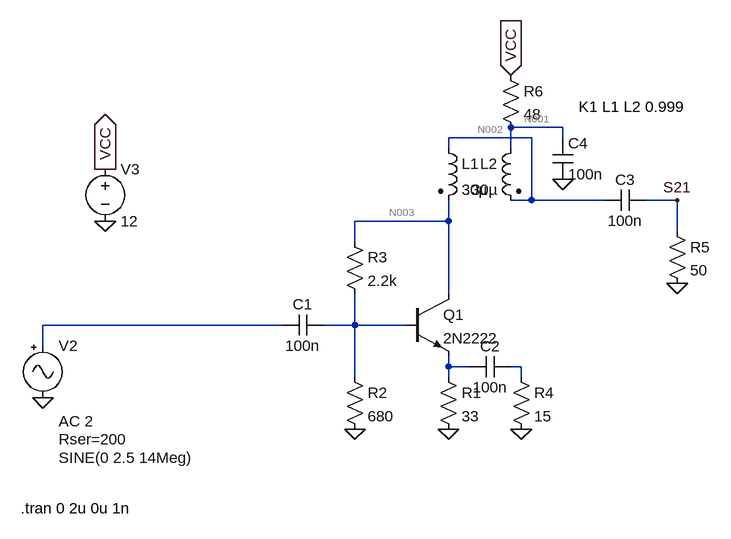
[diagram p0: schematic RF Driver.asc]
RF Driver.asc, the LTspice schematic file:
Version 4
SHEET 1 880 680
WIRE 352 -80 272 -80
WIRE 304 -64 176 -64
WIRE 352 -64 352 -80
WIRE 176 -48 176 -64
WIRE 272 -48 272 -80
WIRE 304 32 304 -64
WIRE 304 32 272 32
WIRE 416 32 304 32
WIRE 528 32 480 32
WIRE 176 64 176 32
WIRE 176 64 32 64
WIRE 528 80 528 32
WIRE 32 96 32 64
WIRE 176 176 176 64
WIRE -80 224 -448 224
WIRE 32 224 32 176
WIRE 32 224 -16 224
WIRE 112 224 32 224
WIRE -448 256 -448 224
WIRE 176 288 176 272
WIRE 208 288 176 288
WIRE 288 288 272 288
WIRE 32 304 32 224
WIRE 176 304 176 288
WIRE 288 304 288 288
FLAG 32 384 0
FLAG 176 384 0
FLAG 352 0 0
FLAG 528 160 0
FLAG -448 336 0
FLAG -352 64 0
FLAG 528 32 S21
FLAG -352 -16 VCC
IOPIN -352 -16 Out
FLAG 272 -160 VCC
IOPIN 272 -160 In
FLAG 288 384 0
SYMBOL npn 112 176 R0
SYMATTR InstName Q1
SYMATTR Value 2N2222
SYMBOL res 160 288 R0
SYMATTR InstName R1
SYMATTR Value 33
SYMBOL res 16 288 R0
SYMATTR InstName R2
SYMATTR Value 680
SYMBOL res 16 80 R0
SYMATTR InstName R3
SYMATTR Value 2.2k
SYMBOL cap -16 208 R90
WINDOW 0 0 32 VBottom 0
WINDOW 3 32 32 VTop 0
SYMATTR InstName C1
SYMATTR Value 100n
SYMBOL cap 480 16 R90
WINDOW 0 0 32 VBottom 0
WINDOW 3 32 32 VTop 0
SYMATTR InstName C3
SYMATTR Value 100n
SYMBOL res 512 64 R0
SYMATTR InstName R5
SYMATTR Value 50
SYMBOL ind2 160 -64 R0
SYMATTR InstName L1
SYMATTR Value 30µ
SYMATTR Type ind
SYMBOL res 256 -176 R0
SYMATTR InstName R6
SYMATTR Value 48
SYMBOL cap 336 -64 R0
SYMATTR InstName C4
SYMATTR Value 100n
SYMBOL Misc\\signal -448 240 R0
WINDOW 3 24 188 Left 0
WINDOW 123 24 132 Left 0
WINDOW 39 24 160 Left 0
SYMATTR InstName V2
SYMATTR Value SINE(0 2.5 14Meg)
SYMATTR Value2 AC 2
SYMATTR SpiceLine Rser=200
SYMBOL voltage -352 -32 R0
WINDOW 123 0 0 Left 0
WINDOW 39 0 0 Left 0
SYMATTR InstName V3
SYMATTR Value 12
SYMBOL ind2 288 -64 M0
SYMATTR InstName L2
SYMATTR Value 30µ
SYMATTR Type ind
SYMBOL cap 272 272 R90
WINDOW 0 0 32 VBottom 0
WINDOW 3 32 32 VTop 0
SYMATTR InstName C2
SYMATTR Value 100n
SYMBOL res 272 288 R0
SYMATTR InstName R4
SYMATTR Value 15
TEXT -482 506 Left 0 !.tran 0 2u 0u 1n
TEXT 376 -112 Left 0 !K1 L1 L2 0.999

The netlist it stands for:
* RF Driver.asc
Q1 N003 N005 N006 0 2N2222
R1 N006 0 33
R2 N005 0 680
R3 N003 N005 2.2k
C1 N005 N004 100n
C3 S21 N002 100n
R5 S21 0 50
L1 N002 N003 30µ
R6 VCC N001 48
C4 N001 0 100n
V2 N004 0 SINE(0 2.5 14Meg) AC 2 Rser=200
V3 VCC 0 12
L2 N001 N002 30µ
C2 N007 N006 100n
R4 N007 0 15
.model NPN NPN
.model PNP PNP
.lib standard.bjt
.tran 0 2u 0u 1n
K1 L1 L2 0.999
.backanno
.end

* Results of the author's LTspice run, read from the files saved beside the schematic
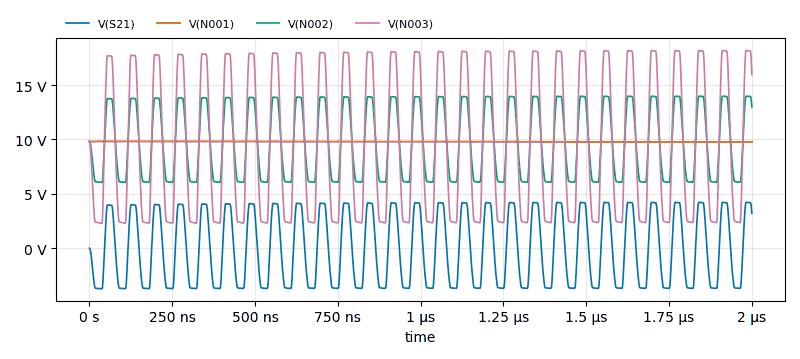
[diagram p1: Transient Analysis of RF Driver.asc, plotted from the saved traces]
* Transient Analysis, 1 run:
*   V(S21): min -3.74 V, max 4.222 V, average -72.59 mV, rms 3.253 V, last 3.211 V
*   V(N001): min 9.763 V, max 9.818 V, average 9.796 V, rms 9.796 V, last 9.763 V
*   V(N002): min 6.046 V, max 13.98 V, average 9.702 V, rms 10.23 V, last 12.99 V
*   V(N003): min 2.276 V, max 18.19 V, average 9.609 V, rms 11.6 V, last 15.98 V